# Altium schematic sheet FPGA_DDR.SchDoc
size A3; SheetNumber: 5; SheetTotal: 5
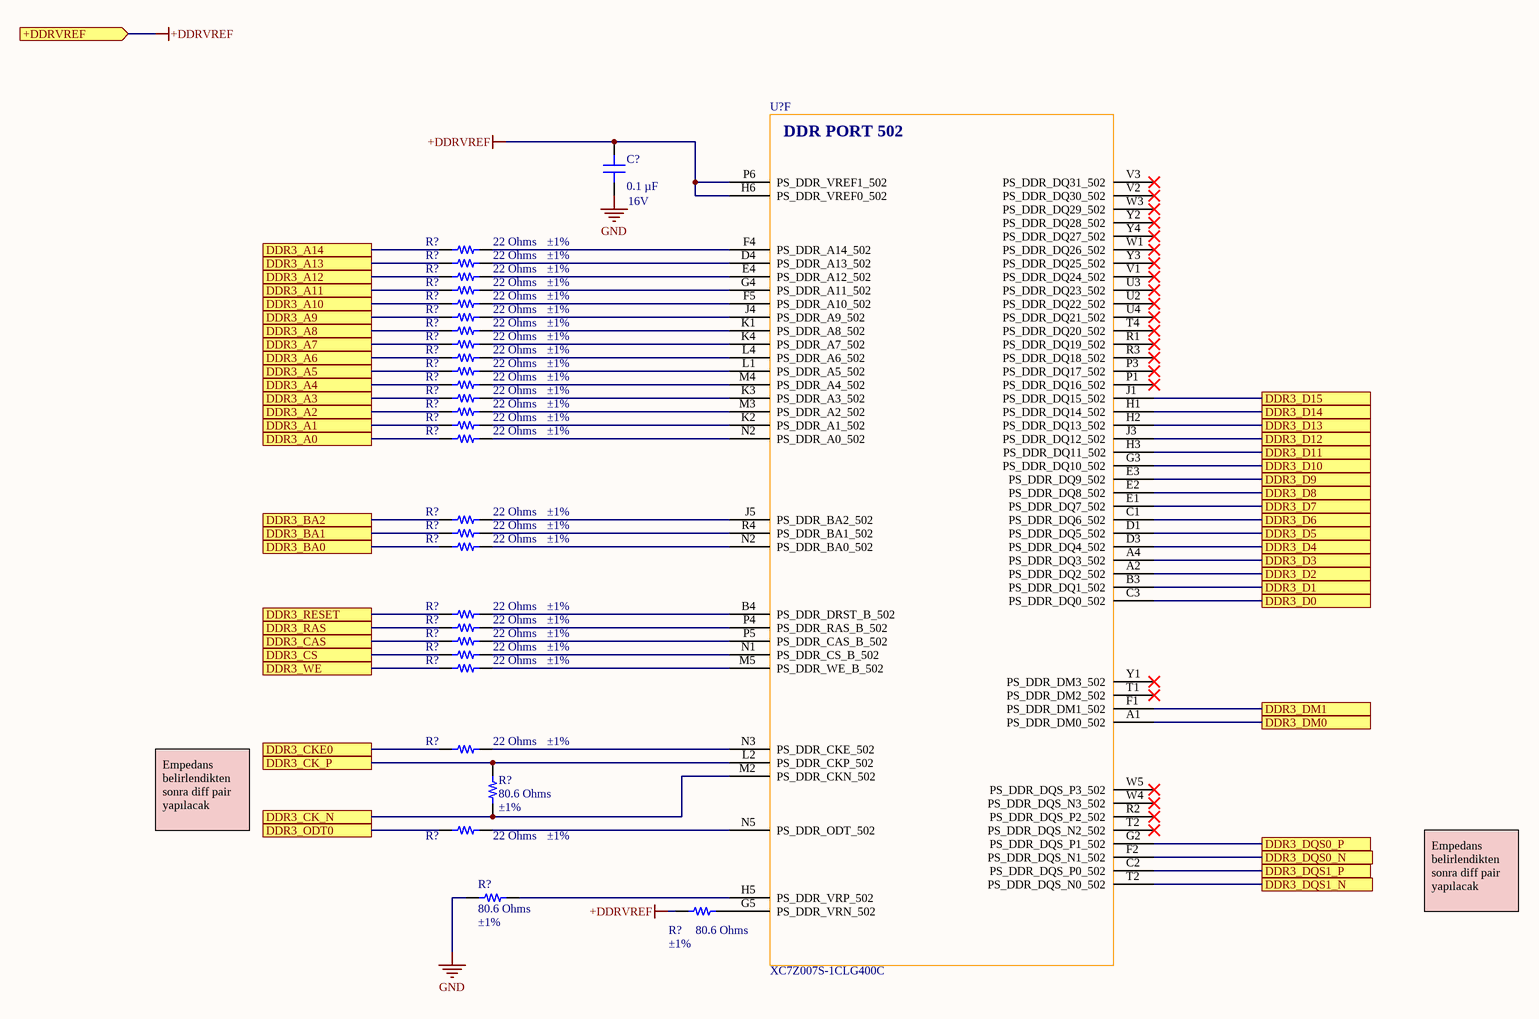
[diagram p0: FPGA_DDR.SchDoc]

## Parts
(Parts that share a designator on the sheet are numbered #1, #2 ... from top to bottom, then left to right.)
C?  Voltage - Rated: 16V  [CAP 0201_0603]  (hidden comment: 0.1 µF)
R?#1  Tolerance: ±1%  [RES 0201_0603]  (hidden comment: 22 Ohms)
R?#2  Tolerance: ±1%  [RES 0201_0603]  (hidden comment: 22 Ohms)
R?#3  Tolerance: ±1%  [RES 0201_0603]  (hidden comment: 22 Ohms)
R?#4  Tolerance: ±1%  [RES 0201_0603]  (hidden comment: 22 Ohms)
R?#5  Tolerance: ±1%  [RES 0201_0603]  (hidden comment: 22 Ohms)
R?#6  Tolerance: ±1%  [RES 0201_0603]  (hidden comment: 22 Ohms)
R?#7  Tolerance: ±1%  [RES 0201_0603]  (hidden comment: 22 Ohms)
R?#8  Tolerance: ±1%  [RES 0201_0603]  (hidden comment: 22 Ohms)
R?#9  Tolerance: ±1%  [RES 0201_0603]  (hidden comment: 22 Ohms)
R?#10  Tolerance: ±1%  [RES 0201_0603]  (hidden comment: 22 Ohms)
R?#11  Tolerance: ±1%  [RES 0201_0603]  (hidden comment: 22 Ohms)
R?#12  Tolerance: ±1%  [RES 0201_0603]  (hidden comment: 22 Ohms)
R?#13  Tolerance: ±1%  [RES 0201_0603]  (hidden comment: 22 Ohms)
R?#14  Tolerance: ±1%  [RES 0201_0603]  (hidden comment: 22 Ohms)
R?#15  Tolerance: ±1%  [RES 0201_0603]  (hidden comment: 22 Ohms)
R?#16  Tolerance: ±1%  [RES 0201_0603]  (hidden comment: 22 Ohms)
R?#17  Tolerance: ±1%  [RES 0201_0603]  (hidden comment: 22 Ohms)
R?#18  Tolerance: ±1%  [RES 0201_0603]  (hidden comment: 22 Ohms)
R?#19  Tolerance: ±1%  [RES 0201_0603]  (hidden comment: 22 Ohms)
R?#20  Tolerance: ±1%  [RES 0201_0603]  (hidden comment: 22 Ohms)
R?#21  Tolerance: ±1%  [RES 0201_0603]  (hidden comment: 22 Ohms)
R?#22  Tolerance: ±1%  [RES 0201_0603]  (hidden comment: 22 Ohms)
R?#23  Tolerance: ±1%  [RES 0201_0603]  (hidden comment: 22 Ohms)
R?#24  Tolerance: ±1%  [RES 0201_0603]  (hidden comment: 22 Ohms)
R?#25  Tolerance: ±1%  [RES 0201_0603]  (hidden comment: 80.6 Ohms)
R?#26  Tolerance: ±1%  [RES 0201_0603]  (hidden comment: 22 Ohms)
R?#27  Tolerance: ±1%  [RES 0201_0603]  (hidden comment: 80.6 Ohms)
R?#28  Tolerance: ±1%  [RES 0201_0603]  (hidden comment: 80.6 Ohms)
U?  XC7Z007S-1CLG400C  [CLG400_XIL]  (part F of 8)

## Ports
+DDRVREF (in), DDR3_A0, DDR3_A1, DDR3_A2, DDR3_A3, DDR3_A4, DDR3_A5, DDR3_A6, DDR3_A7, DDR3_A8, DDR3_A9, DDR3_A10, DDR3_A11, DDR3_A12, DDR3_A13, DDR3_A14, DDR3_BA0, DDR3_BA1, DDR3_BA2, DDR3_CAS, DDR3_CK_N, DDR3_CK_P, DDR3_CKE0, DDR3_CS, DDR3_D0, DDR3_D1, DDR3_D2, DDR3_D3, DDR3_D4, DDR3_D5, DDR3_D6, DDR3_D7, DDR3_D8, DDR3_D9, DDR3_D10, DDR3_D11, DDR3_D12, DDR3_D13, DDR3_D14, DDR3_D15, DDR3_DM0, DDR3_DM1, DDR3_DQS0_N, DDR3_DQS0_P, DDR3_DQS1_N, DDR3_DQS1_P, DDR3_ODT0, DDR3_RAS, DDR3_RESET, DDR3_WE

## Nets
+DDRVREF: C?.2 R?#28.1 U?.H6(PS_DDR_VREF0_502) U?.P6(PS_DDR_VREF1_502) ; port +DDRVREF
GND: C?.1 R?#27.2
DDR3_A0: R?#15.1 ; port DDR3_A0
DDR3_A1: R?#14.1 ; port DDR3_A1
DDR3_A2: R?#13.1 ; port DDR3_A2
DDR3_A3: R?#12.1 ; port DDR3_A3
DDR3_A4: R?#11.1 ; port DDR3_A4
DDR3_A5: R?#10.1 ; port DDR3_A5
DDR3_A6: R?#9.1 ; port DDR3_A6
DDR3_A7: R?#8.1 ; port DDR3_A7
DDR3_A8: R?#7.1 ; port DDR3_A8
DDR3_A9: R?#6.1 ; port DDR3_A9
DDR3_A10: R?#5.1 ; port DDR3_A10
DDR3_A11: R?#4.1 ; port DDR3_A11
DDR3_A12: R?#3.1 ; port DDR3_A12
DDR3_A13: R?#2.1 ; port DDR3_A13
DDR3_A14: R?#1.1 ; port DDR3_A14
DDR3_BA0: R?#18.1 ; port DDR3_BA0
DDR3_BA1: R?#17.1 ; port DDR3_BA1
DDR3_BA2: R?#16.1 ; port DDR3_BA2
DDR3_CAS: R?#21.1 ; port DDR3_CAS
DDR3_CK_N: R?#25.1 U?.M2(PS_DDR_CKN_502) ; port DDR3_CK_N
DDR3_CK_P: R?#25.2 U?.L2(PS_DDR_CKP_502) ; port DDR3_CK_P
DDR3_CKE0: R?#24.1 ; port DDR3_CKE0
DDR3_CS: R?#22.1 ; port DDR3_CS
DDR3_D0: U?.C3(PS_DDR_DQ0_502) ; port DDR3_D0
DDR3_D1: U?.B3(PS_DDR_DQ1_502) ; port DDR3_D1
DDR3_D2: U?.A2(PS_DDR_DQ2_502) ; port DDR3_D2
DDR3_D3: U?.A4(PS_DDR_DQ3_502) ; port DDR3_D3
DDR3_D4: U?.D3(PS_DDR_DQ4_502) ; port DDR3_D4
DDR3_D5: U?.D1(PS_DDR_DQ5_502) ; port DDR3_D5
DDR3_D6: U?.C1(PS_DDR_DQ6_502) ; port DDR3_D6
DDR3_D7: U?.E1(PS_DDR_DQ7_502) ; port DDR3_D7
DDR3_D8: U?.E2(PS_DDR_DQ8_502) ; port DDR3_D8
DDR3_D9: U?.E3(PS_DDR_DQ9_502) ; port DDR3_D9
DDR3_D10: U?.G3(PS_DDR_DQ10_502) ; port DDR3_D10
DDR3_D11: U?.H3(PS_DDR_DQ11_502) ; port DDR3_D11
DDR3_D12: U?.J3(PS_DDR_DQ12_502) ; port DDR3_D12
DDR3_D13: U?.H2(PS_DDR_DQ13_502) ; port DDR3_D13
DDR3_D14: U?.H1(PS_DDR_DQ14_502) ; port DDR3_D14
DDR3_D15: U?.J1(PS_DDR_DQ15_502) ; port DDR3_D15
DDR3_DM0: U?.A1(PS_DDR_DM0_502) ; port DDR3_DM0
DDR3_DM1: U?.F1(PS_DDR_DM1_502) ; port DDR3_DM1
DDR3_DQS0_N: U?.F2(PS_DDR_DQS_N1_502) ; port DDR3_DQS0_N
DDR3_DQS0_P: U?.G2(PS_DDR_DQS_P1_502) ; port DDR3_DQS0_P
DDR3_DQS1_N: U?.T2(PS_DDR_DQS_N2_502) ; port DDR3_DQS1_N
DDR3_DQS1_P: U?.C2(PS_DDR_DQS_P0_502) ; port DDR3_DQS1_P
DDR3_ODT0: R?#26.1 ; port DDR3_ODT0
DDR3_RAS: R?#20.1 ; port DDR3_RAS
DDR3_RESET: R?#19.1 ; port DDR3_RESET
DDR3_WE: R?#23.1 ; port DDR3_WE
NetR?#1_2: R?#1.2 U?.F4(PS_DDR_A14_502)
NetR?#2_2: R?#2.2 U?.D4(PS_DDR_A13_502)
NetR?#3_2: R?#3.2 U?.E4(PS_DDR_A12_502)
NetR?#4_2: R?#4.2 U?.G4(PS_DDR_A11_502)
NetR?#5_2: R?#5.2 U?.F5(PS_DDR_A10_502)
NetR?#6_2: R?#6.2 U?.J4(PS_DDR_A9_502)
NetR?#7_2: R?#7.2 U?.K1(PS_DDR_A8_502)
NetR?#8_2: R?#8.2 U?.K4(PS_DDR_A7_502)
NetR?#9_2: R?#9.2 U?.L4(PS_DDR_A6_502)
NetR?#10_2: R?#10.2 U?.L1(PS_DDR_A5_502)
NetR?#11_2: R?#11.2 U?.M4(PS_DDR_A4_502)
NetR?#12_2: R?#12.2 U?.K3(PS_DDR_A3_502)
NetR?#13_2: R?#13.2 U?.M3(PS_DDR_A2_502)
NetR?#14_2: R?#14.2 U?.K2(PS_DDR_A1_502)
NetR?#15_2: R?#15.2 U?.N2(PS_DDR_A0_502)
NetR?#16_2: R?#16.2 U?.J5(PS_DDR_BA2_502)
NetR?#17_2: R?#17.2 U?.R4(PS_DDR_BA1_502)
NetR?#18_2: R?#18.2 U?.N2(PS_DDR_BA0_502)
NetR?#19_2: R?#19.2 U?.B4(PS_DDR_DRST_B_502)
NetR?#20_2: R?#20.2 U?.P4(PS_DDR_RAS_B_502)
NetR?#21_2: R?#21.2 U?.P5(PS_DDR_CAS_B_502)
NetR?#22_2: R?#22.2 U?.N1(PS_DDR_CS_B_502)
NetR?#23_2: R?#23.2 U?.M5(PS_DDR_WE_B_502)
NetR?#24_2: R?#24.2 U?.N3(PS_DDR_CKE_502)
NetR?#26_2: R?#26.2 U?.N5(PS_DDR_ODT_502)
NetR?#27_1: R?#27.1 U?.H5(PS_DDR_VRP_502)
NetR?#28_2: R?#28.2 U?.G5(PS_DDR_VRN_502)

Not connected (* = marked no-connect by the designer): U? P1(PS_DDR_DQ16_502)* P3(PS_DDR_DQ17_502)* R1(PS_DDR_DQ19_502)* R2(PS_DDR_DQS_P2_502)* R3(PS_DDR_DQ18_502)* T1(PS_DDR_DM2_502)* T4(PS_DDR_DQ20_502)* U2(PS_DDR_DQ22_502)* U3(PS_DDR_DQ23_502)* U4(PS_DDR_DQ21_502)* V1(PS_DDR_DQ24_502)* V2(PS_DDR_DQ30_502)* V3(PS_DDR_DQ31_502)* W1(PS_DDR_DQ26_502)* W3(PS_DDR_DQ29_502)* W4(PS_DDR_DQS_N3_502)* W5(PS_DDR_DQS_P3_502)* Y1(PS_DDR_DM3_502)* Y2(PS_DDR_DQ28_502)* Y3(PS_DDR_DQ25_502)* Y4(PS_DDR_DQ27_502)*

## Notes on the sheet
- Empedans belirlendikten sonra diff pair yapılacak
- (in symbol XC7Z007S-1CLG400C, part F) DDR PORT 502

## Library data of the parts
C? = EMK063BJ104KP-F: CAP CER 0.1UF 16V X5R 0201; manufacturer: Taiyo Yuden; Tolerance: ±10%; Part Number: EMK063BJ104KP-F; Value: 0.1 µF; Applications: SMPS Filtering; Capacitance: 0.1 µF; componentlink1description: Datasheet; componentlink1url: https://ds.yuden.co.jp/TYCOMPAS/ut/detail?pn=EMK063BJ104KP-F  &u=M; componentlink2description: DigiKey Link; componentlink2url: https://www.digikey.com/en/products/detail/taiyo-yuden/EMK063BJ104KP-F/4970625; Device Package: 0201 (0603 Metric); lastupdated: 29.04.2023 19:01:28; Lifecycle Status: Active; Minimum Order: 1; Mounting Type: Surface Mount, MLCC; Operating Temperature: -55°C ~ 85°C; Package / Case: 0201 (0603 Metric); packaging: TapeAndReel; partid: 12; Part Status: Active; price: 0.01; series: M; Size / Dimension: 0.024" L x 0.012" W (0.60mm x 0.30mm); Supplier 1: DigiKey; Supplier Part Number 1: 587-5833-1-ND; Temperature Coefficient: X5R; Thickness (Max): 0.013" (0.33mm)
R?#1-R?#24 R?#26 = ERJ-1GNF22R0C: RES SMD 22 OHM 1% 1/20W 0201; Manufacturer: Panasonic Electronic Components; Power (Watts): 0.05W, 1/20W; Temperature Coefficient: ±200ppm/°C; Part Number: ERJ-1GNF22R0C; Value: 22 Ohms; ComponentLink1Description: Datasheet; ComponentLink1URL: https://industrial.panasonic.com/cdbs/www-data/pdf/RDA0000/AOA0000C304.pdf; ComponentLink2Description: DigiKey Link; ComponentLink2URL: https://www.digikey.com/en/products/detail/panasonic-electronic-components/ERJ-1GNF22R0C/2035920; Composition: Thick Film; Device Package: 0201 (0603 Metric); Features: Automotive AEC-Q200; Height - Seated (Max): 0.010" (0.26mm); LastUpdated: 29.04.2023 19:19:39; Lifecycle Status: Active; Minimum Order: 1; Number of Terminations: 2; Operating Temperature: -55°C ~ 125°C; Package / Case: 0201 (0603 Metric); Packaging: TapeAndReel; PartId: 823; Part Status: Active; Price: 0.01; Ratings: AEC-Q200; Resistance: 22 Ohms; Series: ERJ-1GN; Size / Dimension: 0.024" L x 0.012" W (0.60mm x 0.30mm); Supplier 1: DigiKey; Supplier Part Number 1: P122843CT-ND; Supplier Device Package: 0201
R?#25 R?#27 R?#28 = RK73H1HTTC80R6F: RES 80.6 OHM 1% 1/20W 0201; Manufacturer: KOA Speer Electronics, Inc.; Power (Watts): 0.05W, 1/20W; Temperature Coefficient: ±200ppm/°C; Part Number: RK73H1HTTC80R6F; Value: 80.6 Ohms; ComponentLink1Description: Datasheet; ComponentLink1URL: http://www.koaspeer.com/catimages/Products/RK73H/RK73H.pdf; ComponentLink2Description: DigiKey Link; ComponentLink2URL: https://www.digikey.com/en/products/detail/koa-speer-electronics-inc/RK73H1HTTC80R6F/9843839; Composition: Thick Film; Device Package: 0201 (0603 Metric); Features: Automotive AEC-Q200, Moisture Resistant; Height - Seated (Max): 0.010" (0.26mm); LastUpdated: 29.04.2023 19:19:36; Lifecycle Status: Active; Minimum Order: 1; Number of Terminations: 2; Operating Temperature: -55°C ~ 155°C; Package / Case: 0201 (0603 Metric); Packaging: TapeAndReel; PartId: 1149; Part Status: Active; Price: 0.01; Ratings: AEC-Q200; Resistance: 80.6 Ohms; Series: RK73H; Size / Dimension: 0.024" L x 0.012" W (0.60mm x 0.30mm); Supplier 1: DigiKey; Supplier Part Number 1: 2019-RK73H1HTTC80R6FCT-ND; Supplier Device Package: 0201
U? = XC7Z007S-1CLG400C: No Description Available; Mfr_Name: Xilinx Inc; RefDes: RefDes; Type: Type